# Altium schematic sheet GPS.SchDoc
size A; DocumentNumber: 6; SheetNumber: 6; SheetTotal: 16
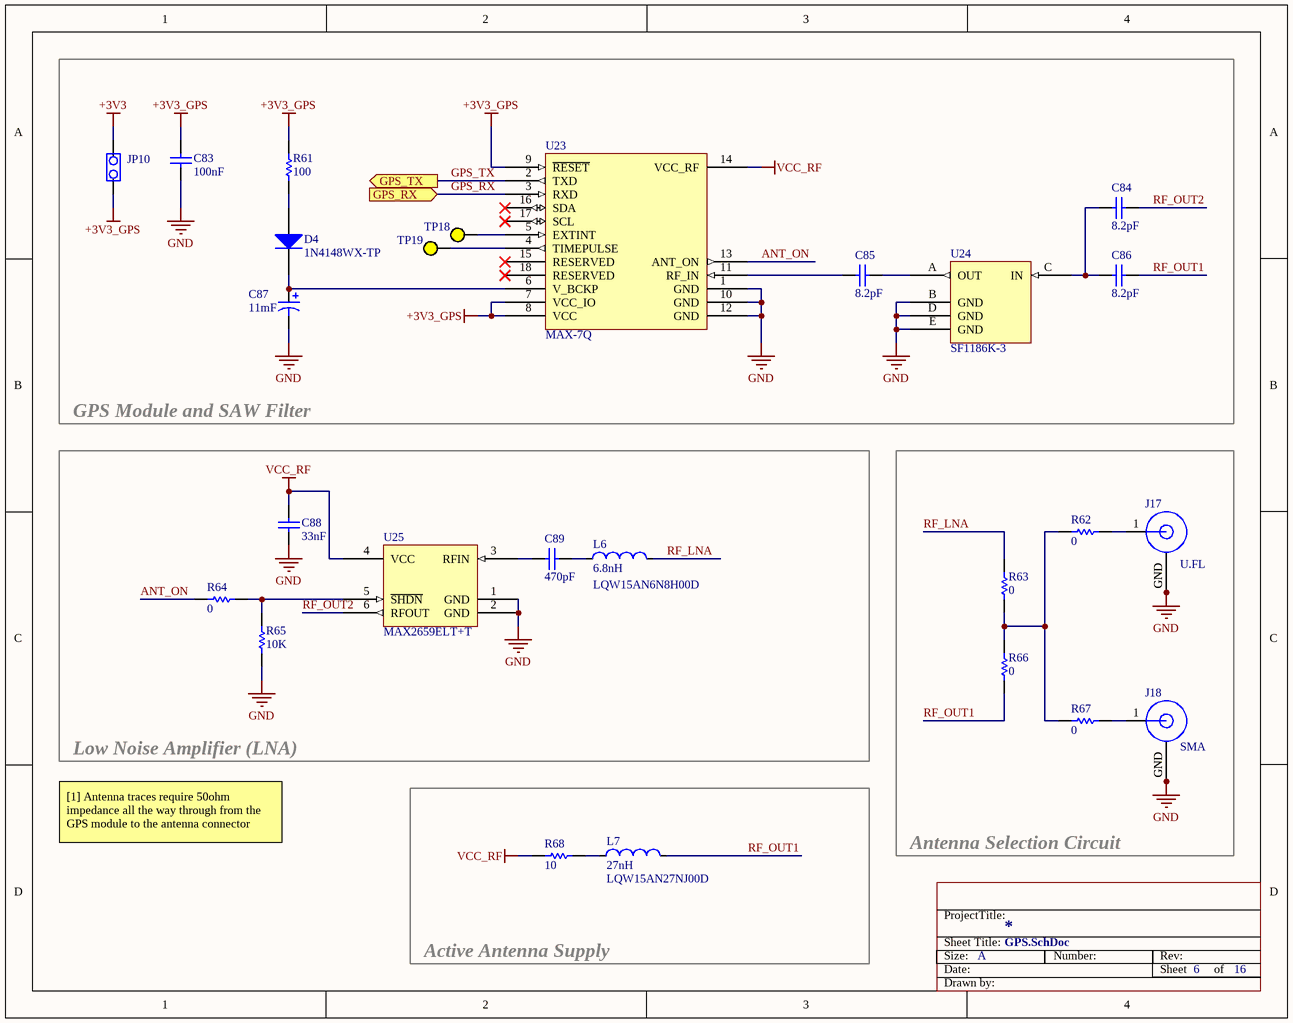
[diagram p0: GPS.SchDoc]

## Parts
C83  value 100nF  [CAP_0402[1005M]]  (hidden comment: Cap)
C84  value 8.2pF  [CAP_0402[1005M]]  (hidden comment: Cap)
C85  value 8.2pF  [CAP_0402[1005M]]  (hidden comment: Cap)
C86  value 8.2pF  [CAP_0402[1005M]]  (hidden comment: Cap)
C87  value 11mF  [SUPERCAP_1210[3225M]]  (hidden comment: CAP_POL)
C88  value 33nF  [CAP_0402[1005M]]  (hidden comment: Cap)
C89  value 470pF  [CAP_0402[1005M]]  (hidden comment: Cap)
D4  Manufacturer Part Number: 1N4148WX-TP  [SOD-323]  (hidden comment: DIODE)
J17  U.FL  [U.FL_1]
J18  SMA  [SMA]
JP10  Jumper  [HDR_1x02_JMP]  (value not drawn)  (no BOM)
L6  6.8nH  Manufacturer Part Number: LQW15AN6N8H00D  [GEN_0402[1005M]]
L7  27nH  Manufacturer Part Number: LQW15AN27NJ00D  [GEN_0402[1005M]]
R61  value 100  [RES_0402[1005M]]  (hidden comment: RES)
R62  value 0  [RES_0402[1005M]]  (hidden comment: RES)
R63  value 0  [RES_0402[1005M]]  (hidden comment: RES)
R64  value 0  [RES_0402[1005M]]  (hidden comment: RES)
R65  value 10K  [RES_0402[1005M]]  (hidden comment: RES)
R66  value 0  [RES_0402[1005M]]  (hidden comment: RES)
R67  value 0  [RES_0402[1005M]]  (hidden comment: RES)
R68  value 10  [RES_0402[1005M]]  (hidden comment: RES)
TP18  Test Point SIG  [TP_SMD_1_SILK]  (value not drawn)  (no BOM)
TP19  Test Point SIG  [TP_SMD_1_SILK]  (value not drawn)  (no BOM)
U23  MAX-7Q  [MAX6/7_GPS]
U24  SF1186K-3  [5-SMD]
U25  MAX2659ELT+T  [uDFN-6]

## Blocks framed on the sheet
GPS Module and SAW Filter: C83-C87 D4 JP10 R61 TP18 TP19 U23 U24
Low Noise Amplifier (LNA): C88 C89 L6 R64 R65 U25
Antenna Selection Circuit: J17 J18 R62 R63 R66 R67
Active Antenna Supply: L7 R68

## Ports
GPS_RX (in), GPS_TX (out)

## Nets
+3V3: JP10.2
+3V3_GPS: C83.2 JP10.1 R61.1 U23.7(VCC_IO) U23.8(VCC) U23.9(~{RESET})
GND: C83.1 C87.2 C88.2 J17.GND J18.GND R65.1 U23.1(GND) U23.10(GND) U23.12(GND) U24.B(GND) U24.D(GND) U24.E(GND) U25.1(GND) U25.2(GND)
VCC_RF: C88.1 R68.1 U23.14(VCC_RF) U25.4(VCC)
ANT_ON: R64.1 U23.13(ANT_ON)
GPS_RX: U23.3(RXD) ; port GPS_RX
GPS_TX: U23.2(TXD) ; port GPS_TX
RF_LNA: L6.2 R63.2
RF_OUT1: C86.1 L7.2 R66.1
RF_OUT2: C84.1 U25.6(RFOUT)
NetC84_2: C84.2 C86.2 U24.C(IN)
NetC85_1: C85.1 U24.A(OUT)
NetC85_2: C85.2 U23.11(RF_IN)
NetC87_1: C87.1 D4.2(K) U23.6(V_BCKP)
NetC89_1: C89.1 L6.1
NetC89_2: C89.2 U25.3(RFIN)
NetD4_1: D4.1(A) R61.2
NetJ17_1: J17.1(OSC1) R62.1
NetJ18_1: J18.1(OSC1) R67.1
NetL7_1: L7.1 R68.2
NetR62_2: R62.2 R63.1 R66.2 R67.2
NetR64_2: R64.2 R65.2 U25.5(~{SHDN})
NetTP18_1: TP18.1 U23.5(EXTINT)
NetTP19_1: TP19.1 U23.4(TIMEPULSE)

Not connected (* = marked no-connect by the designer): U23 15(RESERVED)* 16(SDA)* 17(SCL)* 18(RESERVED)*

## Notes on the sheet
- [1] Antenna traces require 50ohm impedance all the way through from the GPS module to the antenna connector
- Sheet Title:
- ProjectTitle:
- Size:
- Date:
- A
- Number:
- Rev:
- Sheet         of
- Drawn by:

## Library data of the parts
C83 = Cap: Capacitor; Manufacturer: Yageo; Manufacturer Part Number: CC0402KRX7R6BB104; Supplier 1: Digi-Key; Supplier Part Number 1: 311-1345-1-ND; ComponentLink1URL: http://www.yageo.com/documents/recent/UPY-GPHC_X7R_6.3V-to-50V-v12.pdf; ComponentLink1Description: Datasheet
C84-C86 = Cap: Capacitor; Manufacturer: Yageo; Manufacturer Part Number: CC0402BRNPO9BN8R2; Supplier 1: Digi-Key; Supplier Part Number 1: 311-1628-1-ND; ComponentLink1URL: http://www.yageo.com/documents/recent/UPY-GP_NP0_16V-to-50V_10.pdf; ComponentLink1Description: Datasheet
C87 = CAP_POL: Polarized Capacitor; Manufacturer: Seiko Instruments; Manufacturer Part Number: CPH3225A; Supplier 1: Digi-Key; Supplier Part Number 1: 728-1067-1-ND; ComponentLink1URL: http://media.digikey.com/pdf/Data%20Sheets/Seiko%20Instruments%20PDFs/CPH3225A_CP3225A.pdf; ComponentLink1Description: Datasheet
C88 = Cap: Capacitor; Manufacturer Part Number: CL05B333JO5NNNC; Manufacturer: Samsung Electro-Mechanics America, Inc.; Supplier 1: Digi-Key; Supplier Part Number 1: 1276-1553-1-ND; ComponentLink1URL: http://www.samsungsem.com/kr/support/product-search/mlcc/CL05B333JO5NNNC.jsp; ComponentLink1Description: Datasheet
C89 = Cap: Capacitor; Manufacturer Part Number: C1005C0G1H471J050BA; Manufacturer: TDK Corporation; Supplier 1: Digi-Key; Supplier Part Number 1: 445-2656-1-ND; ComponentLink1URL: http://product.tdk.com/en/catalog/datasheets/mlcc_commercial_general_en.pdf; ComponentLink1Description: Datasheet
D4 = DIODE: Typical Diode; Manufacturer: Micro Commercial Co; Current - Reverse Leakage @ Vr: 5µA @ 75V; Current - Average Rectified (Io): 150mA; Supplier 1: Digi-Key; Supplier Part Number 1: 1N4148WXTPMSCT-ND; ComponentLink1URL: http://www.mccsemi.com/up_pdf/1N4148WX(SOD323).pdf; ComponentLink1Description: Datasheet
J17 = U.FL: U.FL RF connector; Manufacturer: Hirose Electric Co Ltd; Manufacturer Part Number: U.FL-R-SMT(10); Impedance: 50 Ohm; Supplier 1: Digi-Key; Supplier Part Number 1: H9161CT-ND; ComponentLink1URL: http://media.digikey.com/pdf/Data%20Sheets/Hirose%20PDFs/UFL%20Series.pdf; ComponentLink1Description: Datasheet
J18 = U.FL: SMA RF connector; Manufacturer: Cinch Connectivity Solutions Johnson; Manufacturer Part Number: 142-0701-801; Dielectric Material: Polytetrafluoroethylene (PTFE); Frequency - Max: 18GHz; Impedance: 50 Ohm; Connector Type: Jack, Female Socket; Supplier 1: Digi-Key; Supplier Part Number 1: J502-ND; ComponentLink1URL: http://cinchconnectivity.com/OA_MEDIA/drawings/dr-1420701801.pdf; ComponentLink1Description: Datasheet; Fastening Type: Threaded; Connector Style: SMA
L6 = Inductor: Chip Inductor; Manufacturer: Murata Electronics North America; Q @ Freq: 25 @ 250MHz; Frequency - Test: 100MHz; Frequency - Self Resonant: 6GHz; DC Resistance (DCR): 90 mOhm Max; Current Rating: 700mA; Value: 6.8nH; Supplier 1: Digi-Key; Supplier Part Number 1: 490-6841-1-ND; ComponentLink1URL: http://search.murata.co.jp/Ceramy/image/img/PDF/ENG/L0075S0080LQW15A_00.pdf; ComponentLink1Description: Datasheet
L7 = Inductor: Chip Inductor; Manufacturer: Murata Electronics North America; Q @ Freq: 25 @ 250MHz; DC Resistance (DCR): 520 mOhm Max; Frequency - Self Resonant: 3.5GHz; Frequency - Test: 100MHz; Current Rating: 280mA; Value: 27nH; ComponentLink1URL: http://search.murata.co.jp/Ceramy/image/img/PDF/ENG/L0075S0080LQW15A_00.pdf; ComponentLink1Description: Datasheet; Supplier 1: Digi-Key; Supplier Part Number 1: 490-1151-1-ND
R61 = RES: Resistor; Manufacturer Part Number: RC0402FR-07100RL; Manufacturer: Yageo; Supplier 1: Digi-Key; Supplier Part Number 1: 311-100LRCT-ND; ComponentLink1URL: http://www.yageo.com/NewPortal/yageodocoutput?fileName=/pdf/R-Chip/PYu-RC_Group_51_RoHS_L_3.pdf; ComponentLink1Description: Datasheet
R62-R64 R66 R67 = RES: Resistor; Manufacturer Part Number: RC0402JR-070RL; Manufacturer: Yageo; Supplier 1: Digi-Key; Supplier Part Number 1: 311-0.0JRCT-ND; ComponentLink1URL: http://www.yageo.com/NewPortal/yageodocoutput?fileName=/pdf/R-Chip/PYu-RC_Group_51_RoHS_L_3.pdf; ComponentLink1Description: Datasheet
R65 = RES: Resistor; Manufacturer: Yageo; Manufacturer Part Number: RC0402FR-0710KL; Supplier 1: Digi-Key; Supplier Part Number 1: 311-10.0KLRCT-ND; ComponentLink1URL: http://www.yageo.com/NewPortal/yageodocoutput?fileName=/pdf/R-Chip/PYu-RC_Group_51_RoHS_L_3.pdf; ComponentLink1Description: Datasheet
R68 = RES: Resistor; Manufacturer: Yageo; Manufacturer Part Number: RC0402FR-0710RL; Supplier 1: Digi-Key; Supplier Part Number 1: 311-10.0LRCT-ND; ComponentLink1URL: http://www.yageo.com/NewPortal/yageodocoutput?fileName=/pdf/R-Chip/PYu-RC_Group_51_RoHS_L_3.pdf; ComponentLink1Description: Datasheet
TP18 TP19 = Test Point SIG: Test Point Signal
U23 = MAX-7Q: u-blox MAX-7Q GNSS Module; Manufacturer: u-blox; Supplier 1: u-blox; Supplier Part Number 1: MAX-7Q; Manufacturer Part Number: MAX-7Q; ComponentLink1Description: Datasheet; ComponentLink1URL: https://www.u-blox.com/sites/default/files/products/documents/MAX-7_DataSheet_(UBX-13004068).pdf; ComponentLink2Description: Manufacturer URL; ComponentLink2URL: https://www.u-blox.com/en/product/max-7-series
U24 = SF1186K-3: GPS SAW Filter; Manufacturer: Murata Electronics North America; Bandwidth: 40MHz; Insertion Loss: 0.9dB; Filter Type: Band Pass; Frequency: 1575.42MHz Center; Supplier 1: Digi-Key; Supplier Part Number 1: 583-1182-1-ND; Package / Case: 5-SMD, No Lead; Applications: GPS; Manufacturer Part Number: SF1186K-3; Size / Dimension: 0.057" L x 0.045" W (1.45mm x 1.15mm); ComponentLink1URL: http://www.rfmchina.com/prouplod/prodt/sf1186k-3.pdf; ComponentLink1Description: Datasheet
U25 = MAX2659: MAX2659 Low Noise Amplifier; Manufacturer: Maxim Integrated; Gain: 20.5dB; Frequency: 1575.42MHz; Current - Supply: 4.1mA; Voltage - Supply: 1.6 V ~ 3.3 V; Supplier 1: Digi-Key; Supplier Part Number 1: MAX2659ELT+TCT-ND; Manufacturer Part Number: MAX2659ELT+T; Package / Case: 6-WFDFN; ComponentLink1URL: http://datasheets.maximintegrated.com/en/ds/MAX2659.pdf; ComponentLink1Description: Datasheet